# Altium schematic sheet [03] - SCHEMATIC.SchDoc (part 3 of 3)
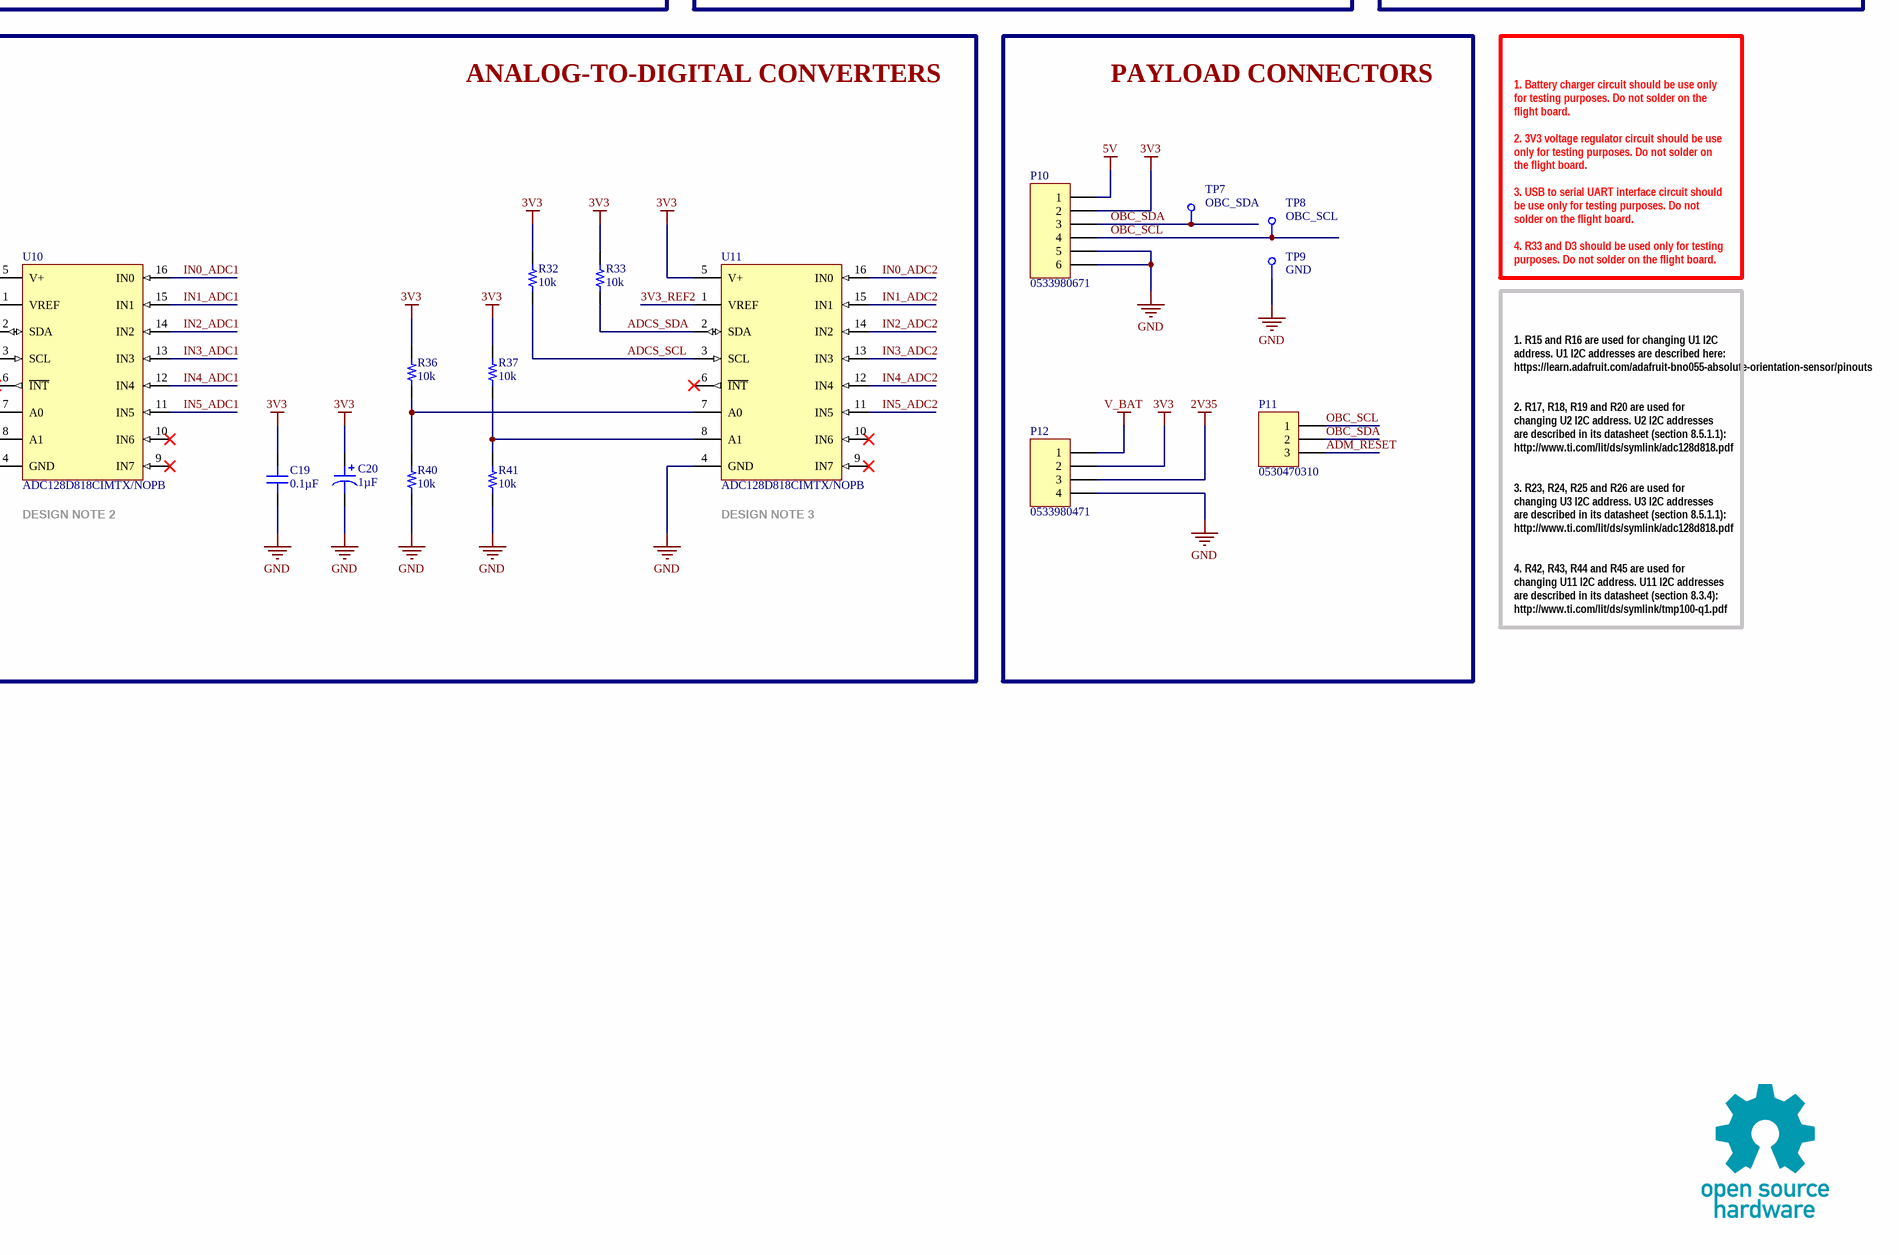
[diagram p5: [03] - SCHEMATIC.SchDoc, bottom right]

## Library data of the parts (continued)
U4 = AP2112K-3.3TRG1: IC REG LDO 3.3V 0.6A SOT25; Manufacturer: Diodes; Minimum Input Voltage: 2.5 V; Typical Quiescent Current: 0.055 mA; Load Regulation: 1000 %/mA; Number of Outputs: 1; Maximum Quiescent Current: 0.08 mA; Junction to Case: 96 C/W; Typical Dropout Voltage @ Current: 0.005@10mA|0.125@300mA|0.25@600mA V; Maximum Input Voltage: 6 V; Max Processing Temp: 260; Maximum Dropout Voltage @ Current: 0.008@10mA|0.2@300mA|0.4@600mA V; Junction to Ambient: 184 C/W; Input Voltage Range: 2.5 to 6 V; Polarity: Positive; Accuracy: 1.5 %; Output Type: Fixed; Screening Level: Industrial; Line Regulation: 0.1 %/V; Supplier 1: Digi-Key; Manufacturer Part Number: AP2112K-3.3TRG1; Stock 1: 156715; Pricing 1: 1=0.48, 10=0.362, 100=0.2255, 500=0.1543, 1000=0.1187 (USD); Function: LDO; Operating Temperature: -40 to 85 C; Mounting: Surface Mount; Output Voltage: 3.3 V; Maximum Output Current: 0.6 A; ComponentLink1URL: https://datasheet.ciiva.com/30016/ap2112-30016792.pdf; ComponentLink1Description: https://datasheet.ciiva.com/30016/ap2112-30016792.pdf; ComponentLink2URL: https://datasheet.ciiva.com/29569/ap2112-29569917.pdf; ComponentLink2Description: https://datasheet.ciiva.com/29569/ap2112-29569917.pdf; ComponentLink3URL: https://datasheet.ciiva.com/29569/ap2112-29569918.pdf; ComponentLink3Description: https://datasheet.ciiva.com/29569/ap2112-29569918.pdf; ComponentLink4URL: https://datasheet.ciiva.com/29569/ap2112-29569919.pdf; ComponentLink4Description: https://datasheet.ciiva.com/29569/ap2112-29569919.pdf; Supplier Part Number 1: AP2112K-3.3TRG1DICT-ND
U5 = ATMEGA328P-AUR: MCU 8-bit ATmega AVR RISC 32KB Flash 2.5V/3.3V/5V 32-Pin TQFP T/R; Manufacturer: Microchip / Atmel; Product Training Modules: MCU Product Line Introduction / megaAVR Introduction; Speed: 20MHz; Connectivity: I²C, SPI, UART/USART; Peripherals: Brown-out Detect/Reset, POR, PWM, WDT; Number of I /O: 23; Program Memory Size: 32KB (16K x 16); EEPROM Size: 1K x 8; RAM Size: 2K x 8; Voltage - Supply (Vcc/Vdd): 1.8 V ~ 5.5 V; Data Converters: A/D 8x10b; Oscillator Type: Internal; Dynamic Catalog: AVR® ATmega; For Use With: ATSTK600-RC29-ND / - STK600 ROUTING CARD AVR; Other Names: ATMEGA328P-AUR-ND; Supplier 1: Digi-Key; Manufacturer Part Number: ATMEGA328P-AUR; Stock 1: 41082; Pricing 1: 1=2.2, 25=2.0248, 100=1.8338 (USD); Standard Package: 2,000; Category: Integrated Circuits (ICs); Family: Embedded - Microcontrollers; Series: AVR® ATmega; Core Processor: AVR; Core Size: 8-Bit; Program Memory Type: FLASH; Operating Temperature: -40°C ~ 85°C; Package / Case: 32-TQFP; Packaging: Tape & Reel (TR); ComponentLink1URL: http://www.atmel.com/images/atmel-8271-8-bit-avr-microcontroller-atmega48a-48pa-88a-88pa-168a-168pa-328-328p_datasheet_summary.pdf; ComponentLink1Description: http://www.atmel.com/images/atmel-8271-8-bit-avr-microcontroller-atmega48a-48pa-88a-88pa-168a-168pa-328-328p_datasheet_summary.pdf; Supplier Part Number 1: ATMEGA328P-AURCT-ND
U6 = FT232RL-REEL: IC USB FS SERIAL UART 28-SSOP; Manufacturer: FTDI; Interface: RS-232,RS-422,RS-485,UART; Number of Channels: 1; Max Supply Voltage: 5.25V; Min Supply Voltage: 3.3V; Data Rate: 12Mbps; Operating Supply Current: 15mA; Voltage: 5V; Supplier 1: Digi-Key; Manufacturer Part Number: FT232RL-REEL; Stock 1: 281044; Pricing 1: 1=4.5, 10=4.05, 100=3.65, 250=3.25, 500=2.85002, 1000=2.65 (USD); Mount: Surface Mount; Case/Package: SSOP; Number of Pins: 28; Weight: 0.080001oz; Min Operating Temperature: -40°C; Max Operating Temperature: 85°C; Packaging: Tape and Reel; Package Quantity: 2000; Number of Transceivers: 1; Length: 10.2mm; Height: 1.75mm; Width: 5.3mm; Radiation Hardening: No; REACH SVHC: No SVHC; Lead Free: Lead Free; ComponentLink1URL: https://datasheet.ciiva.com/34304/2161019-34304054.pdf; ComponentLink1Description: https://datasheet.ciiva.com/34304/2161019-34304054.pdf; ComponentLink2URL: https://datasheet.ciiva.com/1787/ds-ft232r-1787047.pdf; ComponentLink2Description: https://datasheet.ciiva.com/1787/ds-ft232r-1787047.pdf; ComponentLink3URL: https://datasheet.ciiva.com/1787/ds-ft232r-1787048.pdf; ComponentLink3Description: https://datasheet.ciiva.com/1787/ds-ft232r-1787048.pdf; ComponentLink4URL: https://datasheet.ciiva.com/1787/ds-ft232r-1787049.pdf; ComponentLink4Description: https://datasheet.ciiva.com/1787/ds-ft232r-1787049.pdf; ComponentLink5URL: https://datasheet.ciiva.com/4787/ds-ft232r-11534-4787658.pdf; ComponentLink5Description: https://datasheet.ciiva.com/4787/ds-ft232r-11534-4787658.pdf; ComponentLink6URL: https://datasheet.ciiva.com/15150/getdatasheetpartid-643207-15150506.pdf; ComponentLink6Description: https://datasheet.ciiva.com/15150/getdatasheetpartid-643207-15150506.pdf; ComponentLink7URL: https://datasheet.ciiva.com/16200/ds-ft232r-16200652.pdf; ComponentLink7Description: https://datasheet.ciiva.com/16200/ds-ft232r-16200652.pdf; ComponentLink8URL: https://datasheet.ciiva.com/26841/ft232rl-reel-26841080.pdf; ComponentLink8Description: https://datasheet.ciiva.com/26841/ft232rl-reel-26841080.pdf; Supplier Part Number 1: 768-1007-6-ND
U7 U8 = LM4120AIM5-3.3/NOPB: TEXAS INSTRUMENTS   LM4120AIM5-3.3/NOPB   VOLTAGE REF, SERIES, 3.3V, SOT-23-5; Min Input Voltage: 2V; Max Input Voltage: 14V; Max Power Dissipation: 350mW; Tolerance: 0.2%; Nominal Supply Current: 160uA; Max Output Current: 5mA; Temperature Coefficient: 50ppm/°C; Dropout Voltage: 180mV; Number of Channels: 1; Reference Type: Series,Fixed; Supplier 1: Digi-Key; Manufacturer: Texas Instruments; Manufacturer Part Number: LM4120AIM5-3.3/NOPB; Stock 1: 24909; Pricing 1: 1=2.19, 10=1.965, 100=1.5796, 500=1.2978 (USD); Mount: Surface Mount; Case/Package: SOT-23; Number of Pins: 5; Min Operating Temperature: -40°C; Max Operating Temperature: 85°C; Packaging: Tape and Reel; Output Voltage: 3.3V; Package Quantity: 1000; Reference Voltage: 3.3V; Max Output Voltage: 3.3V; Quiescent Current: 160uA; Output Current: 5mA; Length: 2.92mm; Height: 1.02mm; Width: 1.6mm; Radiation Hardening: No; REACH SVHC: No SVHC; Lead Free: Lead Free; ComponentLink1URL: https://datasheet.ciiva.com/15148/getdatasheetpartid-98048-15148598.pdf; ComponentLink1Description: https://datasheet.ciiva.com/15148/getdatasheetpartid-98048-15148598.pdf; ComponentLink2URL: https://datasheet.ciiva.com/3236/lm4120-3236008.pdf; ComponentLink2Description: https://datasheet.ciiva.com/3236/lm4120-3236008.pdf; ComponentLink3URL: https://datasheet.ciiva.com/6597/lm4120-6597544.pdf; ComponentLink3Description: https://datasheet.ciiva.com/6597/lm4120-6597544.pdf; ComponentLink4URL: https://datasheet.ciiva.com/8060/37011-8060248.pdf; ComponentLink4Description: https://datasheet.ciiva.com/8060/37011-8060248.pdf; ComponentLink5URL: https://datasheet.ciiva.com/26064/lm4120-26064202.pdf; ComponentLink5Description: https://datasheet.ciiva.com/26064/lm4120-26064202.pdf; ComponentLink6URL: https://datasheet.ciiva.com/3236/lm4120-3236603.pdf; ComponentLink6Description: https://datasheet.ciiva.com/3236/lm4120-3236603.pdf; ComponentLink7URL: https://datasheet.ciiva.com/6597/lm4120-6597534.pdf; ComponentLink7Description: https://datasheet.ciiva.com/6597/lm4120-6597534.pdf; ComponentLink8URL: https://datasheet.ciiva.com/34301/887588-34301662.pdf; ComponentLink8Description: https://datasheet.ciiva.com/34301/887588-34301662.pdf; Supplier Part Number 1: LM4120AIM5-3.3/NOPBDKR-ND
U9 = TCA4311ADGKR: IC REDRIVER I2C HOTSWAP 8VSSOP; Manufacturer: Texas Instruments; Min Supply Voltage: 2.7V; Max Supply Voltage: 5.5V; Number of Channels: 1; Operating Supply Current: 5.1mA; Max Supply Current: 7mA; Max Frequency: 400kHz; Number of Outputs: 2; Supplier 1: Digi-Key; Manufacturer Part Number: TCA4311ADGKR; Stock 1: 14332; Pricing 1: 1 = 1.46000, 10 = 1.31000, 100 = 1.02100, 500 = 0.84346, 1000 = 0.66590 (USD); RoHS: Yes; Case/Package: VSSOP; Number of Pins: 8; Weight: 0.001058oz; Min Operating Temperature: -40°C; Max Operating Temperature: 85°C; Package Quantity: 1; Packaging: Tape and Reel; Length: 3mm; Depth: 3mm; Radiation Hardening: No; REACH SVHC: No SVHC; Lead Free: Lead Free; ComponentLink1URL: https://datasheet.ciiva.com/1783/tca4311a-1783458.pdf?src-supplier=Digi-Key; ComponentLink1Description: https://datasheet.ciiva.com/1783/tca4311a-1783458.pdf?src-supplier=Digi-Key; ComponentLink2URL: https://datasheet.ciiva.com/15100/getdatasheetpartid-690615-15100141.pdf?src-supplier=Verical; ComponentLink2Description: https://datasheet.ciiva.com/15100/getdatasheetpartid-690615-15100141.pdf?src-supplier=Verical; ComponentLink3URL: https://datasheet.ciiva.com/1783/tca4311a-1783459.pdf?src-supplier=Digi-Key; ComponentLink3Description: https://datasheet.ciiva.com/1783/tca4311a-1783459.pdf?src-supplier=Digi-Key; ComponentLink4URL: https://datasheet.ciiva.com/1783/tca4311a-1783460.pdf?src-supplier=Digi-Key; ComponentLink4Description: https://datasheet.ciiva.com/1783/tca4311a-1783460.pdf?src-supplier=Digi-Key; ComponentLink5URL: https://datasheet.ciiva.com/3222/tca4311a-3222998.pdf?src-supplier=Avnet; ComponentLink5Description: https://datasheet.ciiva.com/3222/tca4311a-3222998.pdf?src-supplier=Avnet; Supplier Part Number 1: 296-28328-1-ND
U10 U11 = ADC128D818CIMTX/NOPB: Analog to Digital Converters - ADC; Manufacturer: TI National Semiconductor; Number of  Elements: 1; Resolution: 12Bit; Architecture: Delta-Sigma; Input Polarity: Unipolar; Input Type: Voltage; Rated Input Volt: 2.56V; Differential Input: Yes; Power Supply Requirement: Single; Single Supply Voltage (Typ): 3.3/5V; Single Supply Voltage (Min): 3V; Single Supply Voltage (Max): 5.5V; Dual Supply Voltage (Typ): Not RequiredV; Differential Linearity Error: ±1LSB; Integral Nonlinearity Error: -2LSB/4LSB; Supplier 1: Digi-Key; Manufacturer Part Number: ADC128D818CIMTX/NOPB; Stock 1: 0; Pricing 1: 1=4.68, 10=4.207, 100=3.4466, 500=2.934, 1000=2.4745 (USD); Dual Supply Voltage (Min): Not RequiredV; Dual Supply Voltage (Max): Not RequiredV; Operating Temp Range: -40C to 125C; Operating Temperature Classification: Automotive; Mounting: Surface Mount; Pin Count: 16; Package Type: TSSOP; Packaging: Tape and Reel; ComponentLink1URL: https://datasheet.ciiva.com/14259/adc128d818-14259977.pdf; ComponentLink1Description: https://datasheet.ciiva.com/14259/adc128d818-14259977.pdf; Supplier Part Number 1: 296-41182-1-ND
Y1 = ABM7-8.000MHZ-D2Y-T: CRYSTAL 8.0000MHZ 18PF SMD; Manufacturer: Abracon; Frequency Tolerance: 20ppm; ESR (Equivalent Series Resistance): 100R; Frequency Stability: 30ppm; Series Resistance: 80R; Supplier 1: Digi-Key; Manufacturer Part Number: ABM7-8.000MHZ-D2Y-T; Stock 1: 151370; Pricing 1: 1=0.72, 10=0.633, 50=0.5912, 100=0.5225, 500=0.495 (USD); Mount: Surface Mount; Case/Package: CSMD; Number of Pins: 2; Min Operating Temperature: -40°C; Max Operating Temperature: 85°C; Frequency: 8MHz; Load Capacitance: 18pF; Package Quantity: 1000; Packaging: Tape and Reel; Tolerance: 20ppm; Termination: SMD/SMT; Composition: Ceramic; Length: 6mm; Height: 0.055inch; Width: 0.138inch; Depth: 3.5mm; Radiation Hardening: No; REACH SVHC: Yes; Lead Free: Lead Free; Supplier Part Number 1: 535-9831-6-ND